# Altium schematic sheet MIC.SchDoc
size A4; Organization: Altium Limited; Address1: L3, 12a Rodborough Rd; Address2: Frenchs Forest; Address3: NSW; Address4: Australia 2086
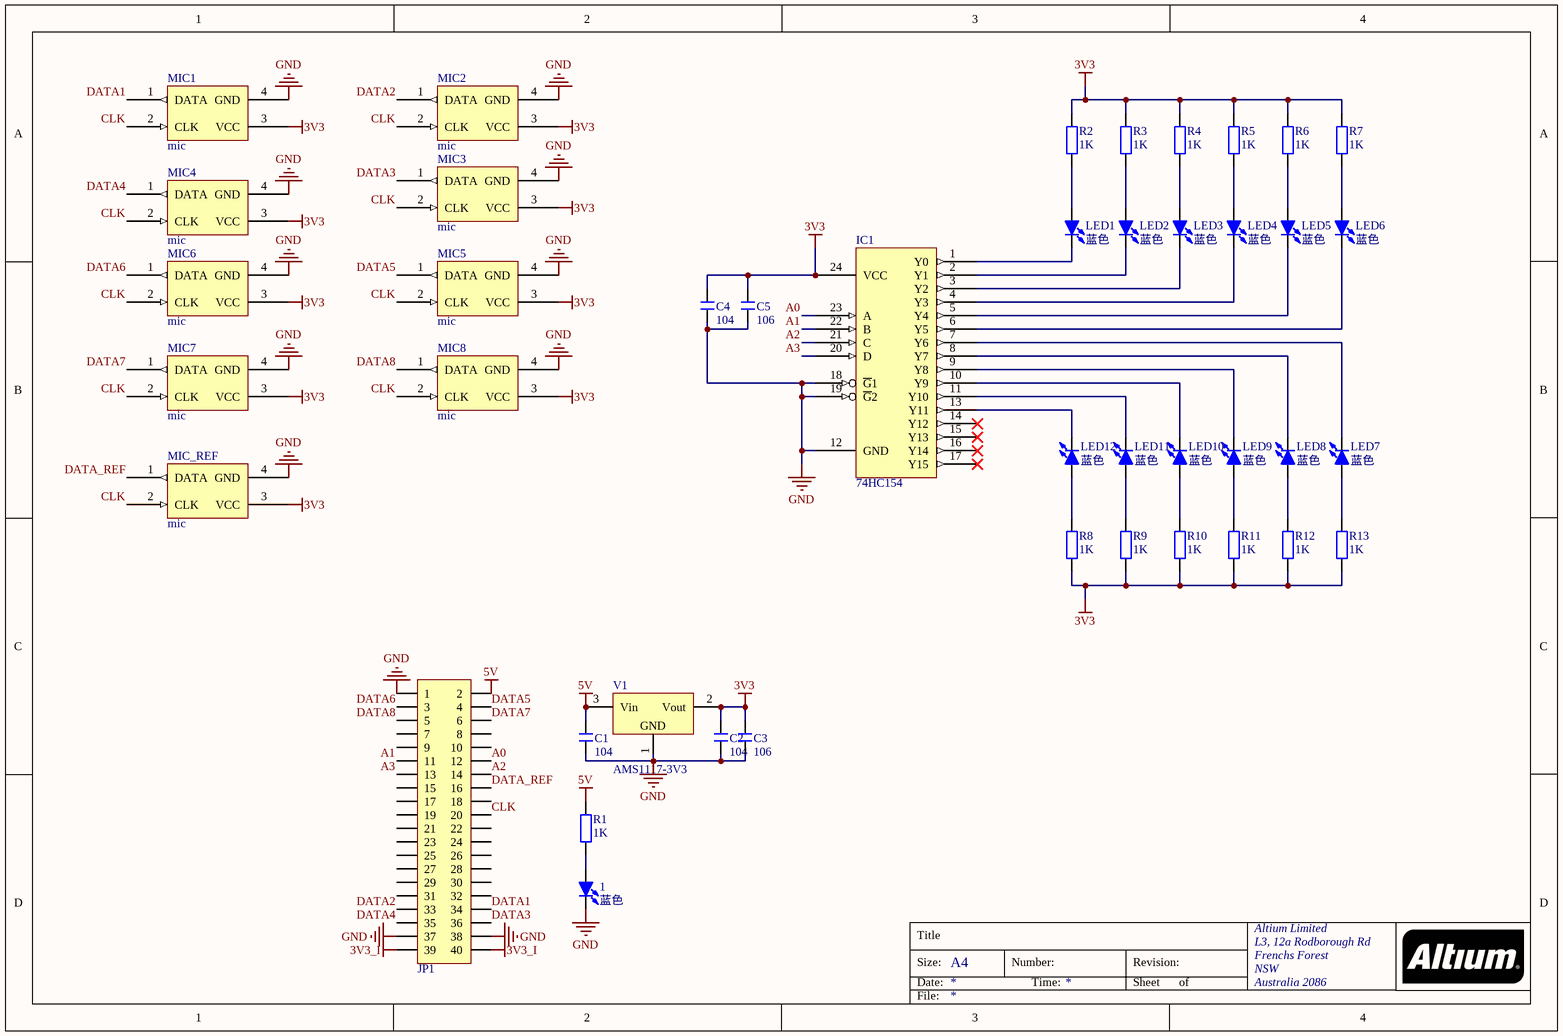
[diagram p0: MIC.SchDoc]

## Parts
1  蓝色  [LED 0603B]
C1  104  [C 0603_L]
C2  104  [C 0603_L]
C3  106  [C 0805_M]
C4  104  [C 0603_L]
C5  106  [C 0805_M]
IC1  74HC154  [SOP24_N]
JP1  Header 2X11  [HDR2.54-LI-2x20P]  (value not drawn)
LED1  蓝色  [LED 0603B]
LED2  蓝色  [LED 0603B]
LED3  蓝色  [LED 0603B]
LED4  蓝色  [LED 0603B]
LED5  蓝色  [LED 0603B]
LED6  蓝色  [LED 0603B]
LED7  蓝色  [LED 0603B]
LED8  蓝色  [LED 0603B]
LED9  蓝色  [LED 0603B]
LED10  蓝色  [LED 0603B]
LED11  蓝色  [LED 0603B]
LED12  蓝色  [LED 0603B]
MIC1  mic  [SDM6601]
MIC2  mic  [SDM6601]
MIC3  mic  [SDM6601]
MIC4  mic  [SDM6601]
MIC5  mic  [SDM6601]
MIC6  mic  [SDM6601]
MIC7  mic  [SDM6601]
MIC8  mic  [SDM6601]
MIC_REF  mic  [SDM6601]
R1  1K  [R 0603_L]
R2  1K  [R 0603_L]
R3  1K  [R 0603_L]
R4  1K  [R 0603_L]
R5  1K  [R 0603_L]
R6  1K  [R 0603_L]
R7  1K  [R 0603_L]
R8  1K  [R 0603_L]
R9  1K  [R 0603_L]
R10  1K  [R 0603_L]
R11  1K  [R 0603_L]
R12  1K  [R 0603_L]
R13  1K  [R 0603_L]
V1  AMS1117-3V3  [SOT223_L]

## Nets
3V3: C2.1 C3.1 C4.1 C5.1 IC1.24(VCC) MIC1.3(VCC) MIC2.3(VCC) MIC3.3(VCC) MIC4.3(VCC) MIC5.3(VCC) MIC6.3(VCC) MIC7.3(VCC) MIC8.3(VCC) MIC_REF.3(VCC) R2.1 R3.1 R4.1 R5.1 R6.1 R7.1 R8.1 R9.1 R10.1 R11.1 R12.1 R13.1 V1.2(Vout)
3V3_I: JP1.39 JP1.40
5V: C1.1 JP1.2 R1.1 V1.3(Vin)
GND: 1.2(K) C1.2 C2.2 C3.2 C4.2 C5.2 IC1.12(GND) IC1.18(~{G}1) IC1.19(~{G}2) JP1.1 JP1.37 JP1.38 MIC1.4(GND) MIC2.4(GND) MIC3.4(GND) MIC4.4(GND) MIC5.4(GND) MIC6.4(GND) MIC7.4(GND) MIC8.4(GND) MIC_REF.4(GND) V1.1(GND)
A0: IC1.23(A) JP1.12
A1: IC1.22(B) JP1.11
A2: IC1.21(C) JP1.14
A3: IC1.20(D) JP1.13
CLK: JP1.20 MIC1.2(CLK) MIC2.2(CLK) MIC3.2(CLK) MIC4.2(CLK) MIC5.2(CLK) MIC6.2(CLK) MIC7.2(CLK) MIC8.2(CLK) MIC_REF.2(CLK)
DATA1: JP1.34 MIC1.1(DATA)
DATA2: JP1.33 MIC2.1(DATA)
DATA3: JP1.36 MIC3.1(DATA)
DATA4: JP1.35 MIC4.1(DATA)
DATA5: JP1.4 MIC5.1(DATA)
DATA6: JP1.3 MIC6.1(DATA)
DATA7: JP1.6 MIC7.1(DATA)
DATA8: JP1.5 MIC8.1(DATA)
DATA_REF: JP1.16 MIC_REF.1(DATA)
Net1_1: 1.1(A) R1.2
NetIC1_1: IC1.1(Y0) LED1.2(K)
NetIC1_2: IC1.2(Y1) LED2.2(K)
NetIC1_3: IC1.3(Y2) LED3.2(K)
NetIC1_4: IC1.4(Y3) LED4.2(K)
NetIC1_5: IC1.5(Y4) LED5.2(K)
NetIC1_6: IC1.6(Y5) LED6.2(K)
NetIC1_7: IC1.7(Y6) LED7.2(K)
NetIC1_8: IC1.8(Y7) LED8.2(K)
NetIC1_9: IC1.9(Y8) LED9.2(K)
NetIC1_10: IC1.10(Y9) LED10.2(K)
NetIC1_11: IC1.11(Y10) LED11.2(K)
NetIC1_13: IC1.13(Y11) LED12.2(K)
NetLED1_1: LED1.1(A) R2.2
NetLED2_1: LED2.1(A) R3.2
NetLED3_1: LED3.1(A) R4.2
NetLED4_1: LED4.1(A) R5.2
NetLED5_1: LED5.1(A) R6.2
NetLED6_1: LED6.1(A) R7.2
NetLED7_1: LED7.1(A) R13.2
NetLED8_1: LED8.1(A) R12.2
NetLED9_1: LED9.1(A) R11.2
NetLED10_1: LED10.1(A) R10.2
NetLED11_1: LED11.1(A) R9.2
NetLED12_1: LED12.1(A) R8.2

Not connected (* = marked no-connect by the designer): IC1 14(Y12)* 15(Y13)* 16(Y14)* 17(Y15)*; JP1 7 8 9 10 15 17 18 19 21 22 23 24 25 26 27 28 29 30 31 32

## Notes on the sheet
- Title
- Size:
- Date:
- A4
- Number:
- Time:
- Revision:
- Sheet
- of
- File:

## Library data of the parts
1 LED1-LED12 = LED-SMD: 贴片LED; 版权归属: 源创客; BOM名称: 贴片LED; 学习资源: www.ooocke.com
C1-C5 = C: 无极性贴片电容; 版权归属: 源创客; BOM名称: 无极性贴片电容; 学习资源: www.ooocke.com
IC1 = 74HC154: 4线转16线译码器; 版权归属: 源创客; BOM名称: 4线转16线译码器; 学习资源: www.ooocke.com
JP1 = Header 20X2: 20*2P接插件; 版权归属: 源创客; BOM名称: 20*2P接插件; 学习资源: www.ooocke.com
MIC1-MIC8 MIC_REF = SDM6601P
R1-R13 = R: 贴片电阻; 版权归属: 源创客; BOM名称: 贴片电阻; 学习资源: www.ooocke.com
V1 = AMS1117: 三端稳压芯片; BOM名称: 稳压芯片; 版权归属: 源创客; 学习资源: www.ooocke.com